# Altium schematic sheet nRF52833.SchDoc: Fogget
size A4; DrawnBy: K Garbicz; Revision: 0.1; SheetNumber: 2; SheetTotal: 7
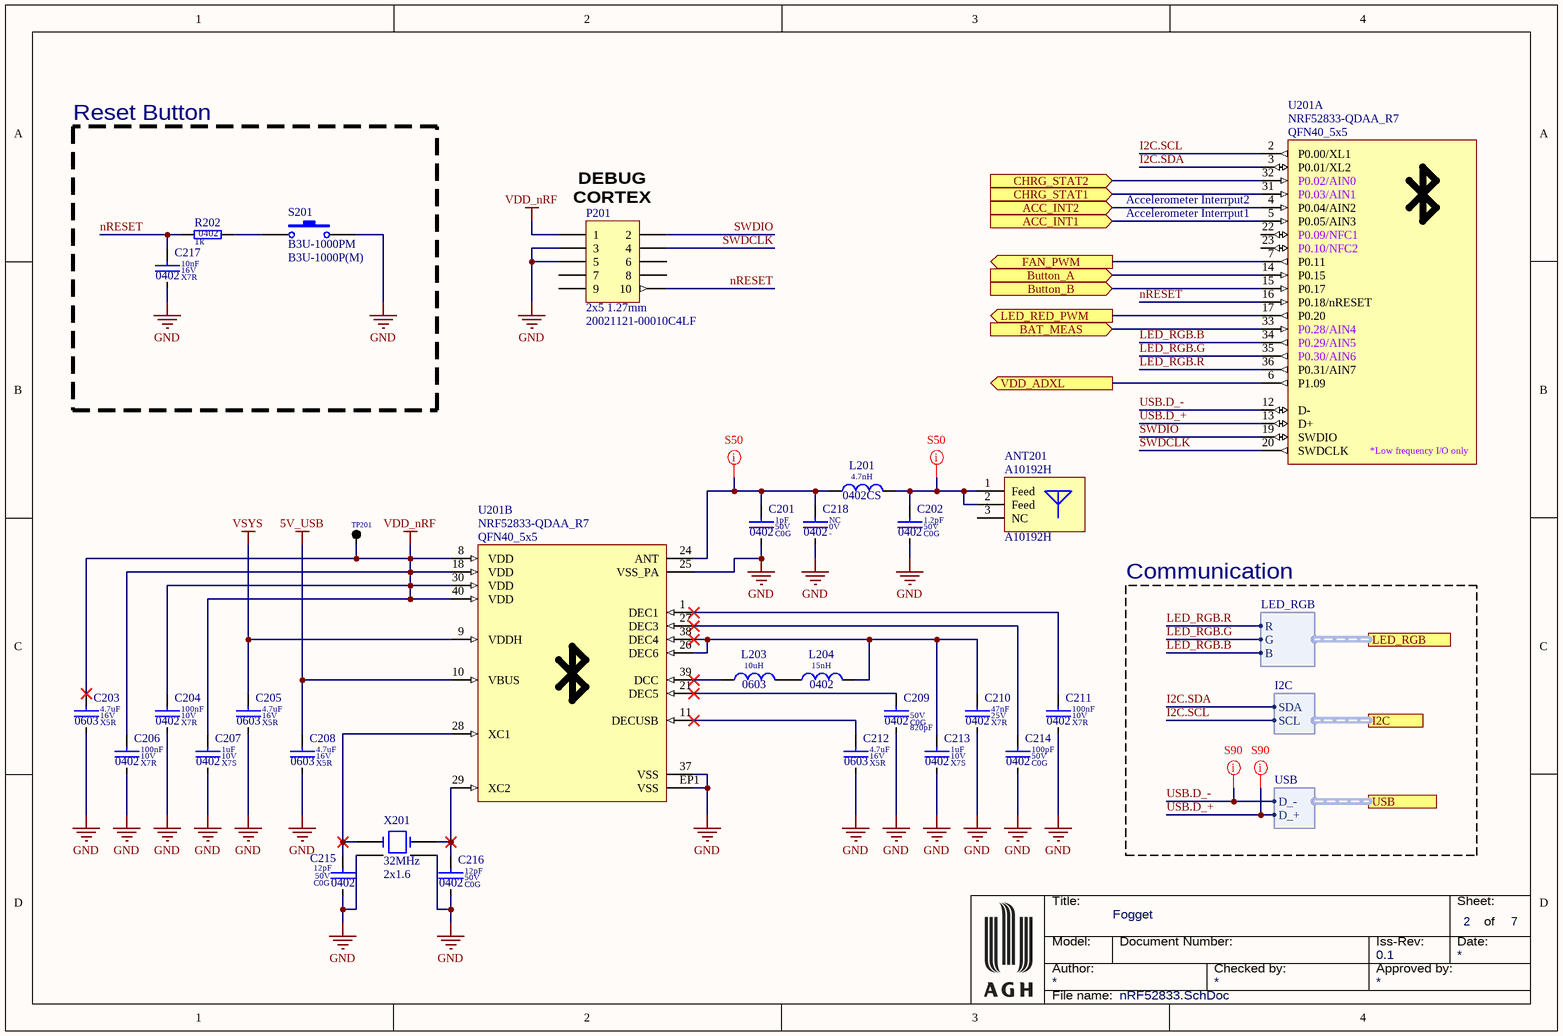
[diagram p0: nRF52833.SchDoc]

## Parts
ANT201  value A10192H  [ANT_A10192H]  (hidden comment: 2.4GHZ SMD antenna)
C201  value 1pF  Dielectric: C0G  Voltage: 50V  SCH_Footprint: 0402  [C_0402_1005]  (hidden comment: Ceramic C0G)
C202  value 1.2pF  Dielectric: C0G  Voltage: 50V  SCH_Footprint: 0402  [C_0402_1005]  (hidden comment: Ceramic C0G)
C203  value 4.7uF  Dielectric: X5R  Voltage: 16V  SCH_Footprint: 0603  [C_0603_1608]  (hidden comment: Ceramic X5R)
C204  value 100nF  Dielectric: X7R  Voltage: 10V  SCH_Footprint: 0402  [C_0402_1005]  (hidden comment: Ceramic X7R)
C205  value 4.7uF  Dielectric: X5R  Voltage: 16V  SCH_Footprint: 0603  [C_0603_1608]  (hidden comment: Ceramic X5R)
C206  value 100nF  Dielectric: X7R  Voltage: 10V  SCH_Footprint: 0402  [C_0402_1005]  (hidden comment: Ceramic X7R)
C207  value 1uF  Dielectric: X7S  Voltage: 10V  SCH_Footprint: 0402  [C_0402_1005]  (hidden comment: Ceramic Capacitor)
C208  value 4.7uF  Dielectric: X5R  Voltage: 16V  SCH_Footprint: 0603  [C_0603_1608]  (hidden comment: Ceramic X5R)
C209  value 820pF  Dielectric: C0G  Voltage: 50V  SCH_Footprint: 0402  [C_0402_1005]  (hidden comment: Ceramic C0G)  (no BOM)
C210  value 47nF  Dielectric: X7R  Voltage: 25V  SCH_Footprint: 0402  [C_0402_1005]  (hidden comment: Ceramic X7R)
C211  value 100nF  Dielectric: X7R  Voltage: 10V  SCH_Footprint: 0402  [C_0402_1005]  (hidden comment: Ceramic X7R)
C212  value 4.7uF  Dielectric: X5R  Voltage: 16V  SCH_Footprint: 0603  [C_0603_1608]  (hidden comment: Ceramic X5R)
C213  value 1uF  Dielectric: X7S  Voltage: 10V  SCH_Footprint: 0402  [C_0402_1005]  (hidden comment: Ceramic Capacitor)
C214  value 100pF  Dielectric: C0G  Voltage: 50V  SCH_Footprint: 0402  [C_0402_1005]  (hidden comment: Ceramic C0G)
C215  value 12pF  Dielectric: C0G  Voltage: 50V  SCH_Footprint: 0402  [C_0402_1005]  (hidden comment: Ceramic C0G)
C216  value 12pF  Dielectric: C0G  Voltage: 50V  SCH_Footprint: 0402  [C_0402_1005]  (hidden comment: Ceramic C0G)
C217  value 10nF  Dielectric: X7R  Voltage: 16V  SCH_Footprint: 0402  [C_0402_1005]  (hidden comment: Ceramic Capacitor)
C218  value NC  Voltage: 0V  SCH_Footprint: 0402  [C_NC_0402_1005]  (hidden comment: -)
L201  value 4.7nH  SCH_Footprint: 0402CS  [L_0402CS]  (hidden comment: Inductor)
L203  value 10uH  SCH_Footprint: 0603  [L_0603_1608]  (hidden comment: Power Inductors)
L204  value 15nH  SCH_Footprint: 0402  [L_0402_1005]  (hidden comment: Inductor)
P201  value 20021121-00010C4LF  SCH_Footprint: 2x5 1.27mm  [P_HEADER_2x5_1.27]  (hidden comment: Jtag)
R202  value 1k  SCH_Footprint: 0402  [R_0402_1005]  (hidden comment: Resistor)
S201  value B3U-1000PM  SCH_Footprint: B3U-1000P(M)  [B3U-1000P]  (hidden comment: Ultra-small Tactile Switch)
TP201  SMD pad  [TP_PAD]  (value not drawn)  (no BOM)
U201  value NRF52833-QDAA_R7  [QFN40_5x5]  (hidden comment: NRF52833-QDAA)  (parts A,B of 2)
X201  value 32MHz  SCH_Footprint: 2x1.6  [X_2x1.6_4PIN]  (hidden comment: 32 MHz Oscilator)

## Blocks framed on the sheet
Reset Button: C217 R202 S201

## Ports
ACC_INT1 (in, see Main[3C], PERIPHERALS[4C], SENSORS[4C]), ACC_INT2 (in, see Main[3C], PERIPHERALS[4C], SENSORS[4C]), BAT_MEAS (in, see Main[2B], POWER[1A]), Button_A (in, see Main[3B], PERIPHERALS[1A]), Button_B (in, see Main[3B], PERIPHERALS[1B]), CHRG_STAT1 (in, see Main[2B], POWER[1C]), CHRG_STAT2 (in, see Main[2B], POWER[1C]), FAN_PWM (out, see Main[3B], PERIPHERALS[2B]), I2C (harness I2C, see Main[3C], PERIPHERALS[4D], SENSORS[4B]), LED_RED_PWM (out, see Main[3B], PERIPHERALS[2C]), LED_RGB (harness LED_RGB, see Main[3B], PERIPHERALS[1D]), USB (harness USB, see Main[2C], USB[4B]), VDD_ADXL (out, see Main[3B], PERIPHERALS[4C], SENSORS[1B])

## Harnesses
I2C: SDA, SCL
LED_RGB: R, G, B
USB: D_-, D_+

## Nets
5V_USB: C208.1 U201.10(VBUS)
GND: C201.2 C202.2 C203.2 C204.2 C205.2 C206.2 C207.2 C208.2 C209.2 C210.2 C211.2 C212.2 C213.2 C214.2 C215.2 C216.2 C217.2 C218.2 P201.3 P201.5 S201.2 U201.25(VSS_PA) U201.37(VSS) U201.EP1(VSS) X201.2(GND) X201.4(GND)
VDD_nRF: C203.1 C204.1 C206.1 C207.1 P201.1 TP201.1(TP) U201.8(VDD) U201.18(VDD) U201.30(VDD) U201.40(VDD)
VSYS: C205.1 U201.9(VDDH)
ACC_INT1: U201.5(P0.05/AIN3) ; port ACC_INT1
ACC_INT2: U201.4(P0.04/AIN2) ; port ACC_INT2
BAT_MEAS: U201.33(P0.28/AIN4) ; port BAT_MEAS
Button_A: U201.14(P0.15) ; port Button_A
Button_B: U201.15(P0.17) ; port Button_B
CHRG_STAT1: U201.31(P0.03/AIN1) ; port CHRG_STAT1
CHRG_STAT2: U201.32(P0.02/AIN0) ; port CHRG_STAT2
FAN_PWM: U201.7(P0.11) ; port FAN_PWM
I2C.SCL: U201.2(P0.00/XL1) ; port I2C.SCL
I2C.SDA: U201.3(P0.01/XL2) ; port I2C.SDA
LED_RED_PWM: U201.17(P0.20) ; port LED_RED_PWM
LED_RGB.B: U201.34(P0.29/AIN5) ; port LED_RGB.B
LED_RGB.G: U201.35(P0.30/AIN6) ; port LED_RGB.G
LED_RGB.R: U201.36(P0.31/AIN7) ; port LED_RGB.R
nRESET: C217.1 P201.10 R202.1 U201.16(P0.18/nRESET)
SWDCLK: P201.4 U201.20(SWDCLK)
SWDIO: P201.2 U201.19(SWDIO)
USB.D_+: U201.13(D+) ; port USB.D_+
USB.D_-: U201.12(D-) ; port USB.D_-
VDD_ADXL: U201.6(P1.09) ; port VDD_ADXL
NetANT201_1: ANT201.1(Feed) ANT201.2(Feed) C202.1 L201.2
NetC201_1: C201.1 C218.1 L201.1 U201.24(ANT)
NetC209_1: C209.1 U201.21(DEC5)
NetC210_1: C210.1 C213.1 L204.2 U201.26(DEC6) U201.38(DEC4)
NetC211_1: C211.1 U201.1(DEC1)
NetC212_1: C212.1 U201.11(DECUSB)
NetC214_1: C214.1 U201.27(DEC3)
NetC215_1: C215.1 U201.28(XC1) X201.3
NetC216_1: C216.1 U201.29(XC2) X201.1
NetL203_1: L203.1 U201.39(DCC)
NetL203_2: L203.2 L204.1
NetR202_2: R202.2 S201.1

Not connected (* = marked no-connect by the designer): ANT201 3(NC); P201 6 7 8 9; U201 22(_P0.09/NFC1) 23(_P0.10/NFC2)

## Layout directives
net class S50: NetANT201_1, NetC201_1
net class S90: USB.D_+, USB.D_-

## Notes on the sheet
- (near P201) DEBUG
  CORTEX
- (near U201) Accelerometer Interrput1
- (near U201) Accelerometer Interrput2
- Communication
- Title:
- Sheet:
- of
- Author:
- Model:
- Document Number:
- Checked by:
- Iss-Rev:
- Approved by:
- Date:
- File name:
- (in symbol UP_NRF52833-QDAA, part A) *Low frequency I/O only

## Library data of the parts
ANT201 = ANT_A10192H: Manufacturer: Antenova; SCH_Footprint: A10192H; Part Number: ANT_A10192H; HelpURL: https://www.antenova.com/wp-content/uploads/2021/03/Fusca-A10192H-PS-1.2.pdf; Manufacturer Part Number: A10192H; Supplier 1: TME; Supplier 2: RS Components; Supplier 3: Farnell; Supplier 4: Mouser; Supplier Part Number 4: 237-A10192H; Supplier 5: Digi-Key; Supplier Part Number 5: 627-1128-1-ND; Supplier 6: LCSC
C201 = C_1pF_50V_C0G_0402_10: Capacitor; Manufacturer: Murata; Manufacturer Part Number: GRM1555C1H1R0BA01D; Tolerance (%): 10; Part Number: C_1pF_50V_C0G_0402_10; HelpURL: http://www.tme.eu/en/Document/5947ce51172a7aff0401fb95866ce9a2/GRM1555C1H1R0BA01-01.pdf; Supplier 1: TME; Supplier Part Number 1: GRM1555C1H1R0BA01D; Supplier 2: RS Components; Supplier Part Number 2: 7235335; Supplier 3: Farnell; Supplier Part Number 3: 2611893; Supplier 4: Mouser; Supplier Part Number 4: 81-GRM1555C1H1R0BA1D; Supplier 5: Digi-Key; Supplier Part Number 5: 490-6206-1-ND; Supplier 6: LCSC
C202 = C_1.2pF_50V_C0G_0402_4: Capacitor; Manufacturer: Murata; Manufacturer Part Number: GJM1555C1H1R2WB01D; Tolerance (%): 4; Part Number: C_1.2pF_50V_C0G_0402_4; HelpURL: https://datasheet.octopart.com/GJM1555C1H1R2WB01D-Murata-datasheet-138724563.pdf; Supplier 1: TME; Supplier 2: RS Components; Supplier Part Number 2: 8467246; Supplier 3: Farnell; Supplier Part Number 3: 2781428; Supplier 4: Mouser; Supplier Part Number 4: 81-GJM1555C1H1R2WB1D; Supplier 5: Digi-Key; Supplier Part Number 5: 490-11195-1-ND; Supplier 6: LCSC
C203 C205 C208 C212 = C_4.7uF_16V_X5R_0603_10: Capacitor; Manufacturer: Murata; Manufacturer Part Number: GRM188R61C475KAAJD; Tolerance (%): 10; Part Number: C_4.7uF_16V_X5R_0603_10; HelpURL: https://datasheet.octopart.com/GRM188R61C475KAAJD-Murata-datasheet-66077093.pdf; Supplier 1: TME; Supplier 2: RS Components; Supplier Part Number 2: 884-7264P; Supplier 3: Farnell; Supplier Part Number 3: 2611924; Supplier 4: Mouser; Supplier Part Number 4: 81-GRM188R61C475KAJD; Supplier 5: Digi-Key; Supplier Part Number 5: 490-10481-2-ND; Supplier 6: LCSC
C204 C206 C211 = C_100nF_10V_X7R_0402_10: Capacitor; Manufacturer: Murata; Manufacturer Part Number: GRM155R71A104KA01D; Tolerance (%): 10; Part Number: C_100nF_10V_X7R_0402_10; HelpURL: https://octopart.com/datasheet/grm155r71a104ka01d-murata-6810561; Supplier 1: TME; Supplier Part Number 1: GRM155R71A104KA01D; Supplier 2: RS Components; Supplier 3: Farnell; Supplier Part Number 3: 1828860; Supplier 4: Mouser; Supplier Part Number 4: 81-GRM155R71A104KA1D; Supplier 5: Digi-Key; Supplier Part Number 5: 490-6321-1-ND; Supplier 6: LCSC
C207 C213 = C_1uF_10V_X7S_0402_10: Capacitor; Manufacturer: Murata; Manufacturer Part Number: GRM155C71A105KE11D; Tolerance (%): 10; Part Number: C_1uF_10V_X7S_0402_10; HelpURL: https://datasheet.octopart.com/GRM155C71A105KE11D-Murata-datasheet-138740431.pdf; Supplier 1: TME; Supplier 2: RS Components; Supplier 3: Farnell; Supplier Part Number 3: 3582785; Supplier 4: Mouser; Supplier Part Number 4: 81-GRM155C71A105KE1D; Supplier 5: Digi-Key; Supplier Part Number 5: 490-14457-1-ND; Supplier 6: LCSC
C209 = C_820pF_50V_C0G_0402_5: Capacitor; Manufacturer: Murata; Manufacturer Part Number: GRM1555C1H821JA01D; Tolerance (%): 5; Part Number: C_820pF_50V_C0G_0402_5; HelpURL: https://www.murata.com/~/media/webrenewal/support/library/catalog/products/capacitor/mlcc/c02e.ashx; Supplier 1: TME; Supplier Part Number 1: GRM1555C1H821JA01D; Supplier 2: RS Components; Supplier Part Number 2: 1694052; Supplier 3: Farnell; Supplier Part Number 3: 2494208; Supplier 4: Mouser; Supplier Part Number 4: 81-GRM1555C1H821JA1D; Supplier 5: Digi-Key; Supplier Part Number 5: 490-3242-1-ND; Supplier 6: LCSC
C210 = C_47nF_25V_X7R_0402_10: Capacitor; Manufacturer: Murata; Manufacturer Part Number: GRM155R71E473KA88D; Tolerance (%): 10; Part Number: C_47nF_25V_X7R_0402_10; HelpURL: http://www.tme.eu/pl/Document/a1d29ce6b65a02ff196c94fe6adcadd2/GRM155R71E473KA88-01.pdf; Supplier 1: TME; Supplier Part Number 1: GRM155R71E473KA88D; Supplier 2: RS Components; Supplier Part Number 2: 7235256; Supplier 3: Farnell; Supplier Part Number 3: 1828868; Supplier 4: Mouser; Supplier Part Number 4: 81-GRM155R71E473KA88; Supplier 5: Digi-Key; Supplier Part Number 5: 490-3254-1-ND; Supplier 6: LCSC
C214 = C_100pF_50V_C0G_0402_5: Capacitor; Manufacturer: Murata; Manufacturer Part Number: GRM1555C1H101JA01D; Tolerance (%): 5; Part Number: C_100pF_50V_C0G_0402_5; HelpURL: http://www.tme.eu/en/Document/e3e731e59cc68b1ab6d46b158bb05733/MURATA_GRM.pdf; Supplier 1: TME; Supplier Part Number 1: GRM1555C1H101JA01D; Supplier 2: RS Components; Supplier Part Number 2: 7235363; Supplier 3: Farnell; Supplier Part Number 3: 2218836; Supplier 4: Mouser; Supplier Part Number 4: 81-GRM1555C1H101JA1D; Supplier 5: Digi-Key; Supplier Part Number 5: 490-5922-1-ND; Supplier 6: LCSC
C215 C216 = C_12pF_50V_C0G_0402_5: Capacitor; Manufacturer: Murata; Manufacturer Part Number: GRM1555C1H120JA01D; Tolerance (%): 5; Part Number: C_12pF_50V_C0G_0402_5; HelpURL: http://datasheet.octopart.com/GRM1555C1H120JA01D-Murata-datasheet-62317045.pdf; Supplier 1: TME; Supplier Part Number 1: GRM1555C1H120JA01D; Supplier 2: RS Components; Supplier Part Number 2: 7235367; Supplier 3: Farnell; Supplier Part Number 3: 1828875; Supplier 4: Mouser; Supplier Part Number 4: 81-GRM1555C1H120JA1D; Supplier 5: Digi-Key; Supplier Part Number 5: 490-5924-1-ND; Supplier 6: LCSC
C217 = C_10nF_16V_X7R_0402_10: Capacitor; Manufacturer: Yageo; Manufacturer Part Number: CC0402KRX7R7BB103; Tolerance (%): 10; Part Number: C_10nF_16V_X7R_0402_10; HelpURL: https://datasheet.octopart.com/CC0402KRX7R7BB103-Yageo-datasheet-10883670.pdf; Supplier 1: TME; Supplier Part Number 1: CC0402KRX7R7103; Supplier 2: RS Components; Supplier Part Number 2: 6698688; Supplier 3: Farnell; Supplier Part Number 3: 3019275; Supplier 4: Mouser; Supplier Part Number 4: 603-CC402KRX7R7BB103; Supplier 5: Digi-Key; Supplier Part Number 5: 311-1042-1-ND; Supplier 6: LCSC
C218 = C_GENERIC_0402: Capacitor; Tolerance (%): 0; Dielectric: -; Part Number: C_GENERIC_0402; HelpURL: -; Manufacturer: -; Manufacturer Part Number: -; Supplier 1: TME; Supplier 2: RS Components; Supplier 3: Farnell; Supplier 4: Mouser; Supplier 5: Digi-Key; Supplier 6: LCSC
L201 = L_4.7nH_640mA_0402CS: Induction; Manufacturer: Coilcraft; Manufacturer Part Number: 0402CS-4N7XJRW; Current: 640mA; Resistance: 130mR; Part Number: L_4.7nH_640mA_0402CS; HelpURL: https://www.coilcraft.com/getmedia/f6cf468d-46eb-4342-9245-4b8b34f8d1bb/0402cs.pdf; Supplier 1: TME; Supplier 2: RS Components; Supplier 3: Farnell; Supplier Part Number 3: 2285711; Supplier 4: Mouser; Supplier Part Number 4: 994-0402CS-4N7XJRW; Supplier 5: Digi-Key; Supplier Part Number 5: 2457-0402CS-4N7XJRW; Supplier 6: LCSC; Supplier 7: Coilcraft; Supplier Part Number 7: 0402CS-4N7XJRW
L203 = L_10uH_300mA_LQM18DZ100M70L: Induction; Manufacturer: Murata; Current: 300mA; Resistance: 1R05; Part Number: L_10uH_300mA_LQM18DZ100M70L; HelpURL: https://search.murata.co.jp/Ceramy/image/img/P02/JELF243B-9128.pdf; Manufacturer Part Number: LQM18DZ100M70L; Supplier 1: TME; Supplier Part Number 1: LQM18DZ100M70L; Supplier 2: RS Components; Supplier 3: Farnell; Supplier 4: Mouser; Supplier Part Number 4: 81-LQM18DZ100M70L; Supplier 5: Digi-Key; Supplier Part Number 5: 490-LQM18DZ100M70LCT-ND; Supplier 6: LCSC
L204 = L_15nH_460mA_0402: Induction; Manufacturer: Murata; Manufacturer Part Number: LQW15AN15NJ00D; Current: 460mA; Resistance: 160mR; Part Number: L_15nH_460mA_0402; HelpURL: http://datasheet.octopart.com/LQW15AN15NJ00D-Murata-datasheet-12510052.pdf; Supplier 1: TME; Supplier Part Number 1: LQW15AN15NJ00D; Supplier 2: RS Components; Supplier Part Number 2: 107766; Supplier 3: Farnell; Supplier Part Number 3: 2672844; Supplier 4: Mouser; Supplier Part Number 4: 81-LQW15AN15NJ00D; Supplier 5: Digi-Key; Supplier Part Number 5: 490-1148-1-ND; Supplier 6: LCSC
P201 = P_HEADER_2x5_1.27: Pin Header; Manufacturer: FCI; Part Number: P_HEADER_2x5_1.27; HelpURL: http://www.mouser.com/catalog/645/usd/1591.pdf; Manufacturer Part Number: 20021121-00010C4LF; Supplier 1: TME; Supplier Part Number 1: 20021121-00010C4LF; Supplier 2: RS Components; Supplier Part Number 2: 794-4584; Supplier 3: Farnell; Supplier Part Number 3: 1865279; Supplier 4: Mouser; Supplier Part Number 4: 649-202112100010C4LF; Supplier 5: Digi-Key; Supplier Part Number 5: 609-3695-1-ND; Supplier 6: LCSC
R202 = R_1k_0402_1: Manufacturer: Yageo; Manufacturer Part Number: RC0402FR-071K; Voltage: 50V; Power: 63mW; Tolerance: 1%; Part Number: R_1k_0402_1; HelpURL: http://www.tme.eu/pl/Document/1a2bc76e2be68b3b1670068306778ce6/rc0402yageo.pdf; Supplier 1: TME; Supplier Part Number 1: RC0402FR-071K; Supplier 2: RS Components; Supplier 3: Farnell; Supplier Part Number 3: 9239235; Supplier 4: Mouser; Supplier Part Number 4: 603-RC0402FR-071KP; Supplier 5: Digi-Key; Supplier Part Number 5: 311-1.00KLRCT-ND; Supplier 6: LCSC
S201 = S_B3U-1000PM: Tact Switch; Manufacturer: OMRON; Part Number: S_B3U-1000PM; HelpURL: https://www.tme.eu/Document/abdade7e1ca56d20235b5c747d7227eb/B3U.PDF; Manufacturer Part Number: B3U-1000PM; Supplier 1: TME; Supplier Part Number 1: B3U-1000PM; Supplier 2: RS Components; Supplier 3: Farnell; Supplier 4: Mouser; Supplier Part Number 4: 653-B3U-1000PM; Supplier 5: Digi-Key; Supplier 6: LCSC
TP201 = TP_PAD: Testpoint; Value: -; SCH_Footprint: SMD; Part Number: TP_PAD; HelpURL: -; Manufacturer: -; Manufacturer Part Number: -; Supplier 1: TME; Supplier 2: RS Components; Supplier 3: Farnell; Supplier 4: Mouser; Supplier 5: Digi-Key; Supplier 6: LCSC; Supplier 7: -; Supplier Part Number 7: -
U201 = UP_NRF52833-QDAA: Manufacturer: Nordic Semiconductor; SCH_Footprint: QFN40_5x5; Part Number: UP_NRF52833-QDAA; HelpURL: https://docs-be.nordicsemi.com/bundle/ps_nrf52833/attach/nRF52833_PS_v1.7.pdf?_LANG=enus; Manufacturer Part Number: NRF52833-QDAA_R7; Supplier 1: TME; Supplier 2: RS Components; Supplier 3: Farnell; Supplier 4: Mouser; Supplier Part Number 4: 949-NRF52833-QDAA-R7; Supplier 5: Digi-Key; Supplier Part Number 5: 4823-NRF52833-QDAA-R7CT-ND; Supplier 6: LCSC
X201 = X_NX2016SA-32M-EXS00A-CS06465: Manufacturer: NDK; Part Number: X_NX2016SA-32M-EXS00A-CS06465; HelpURL: https://pl.mouser.com/datasheet/2/905/ndk_08142018_NX2016SA-32M-EXS00A-CS06465_SS-1389053.pdf; Supplier 1: TME; Supplier 2: RS Components; Supplier 3: Farnell; Supplier 4: Mouser; Supplier Part Number 4: 344-NX2016SA32S06465; Supplier 5: Digi-Key; Supplier Part Number 5: 644-1300-1-ND; Supplier 6: LCSC